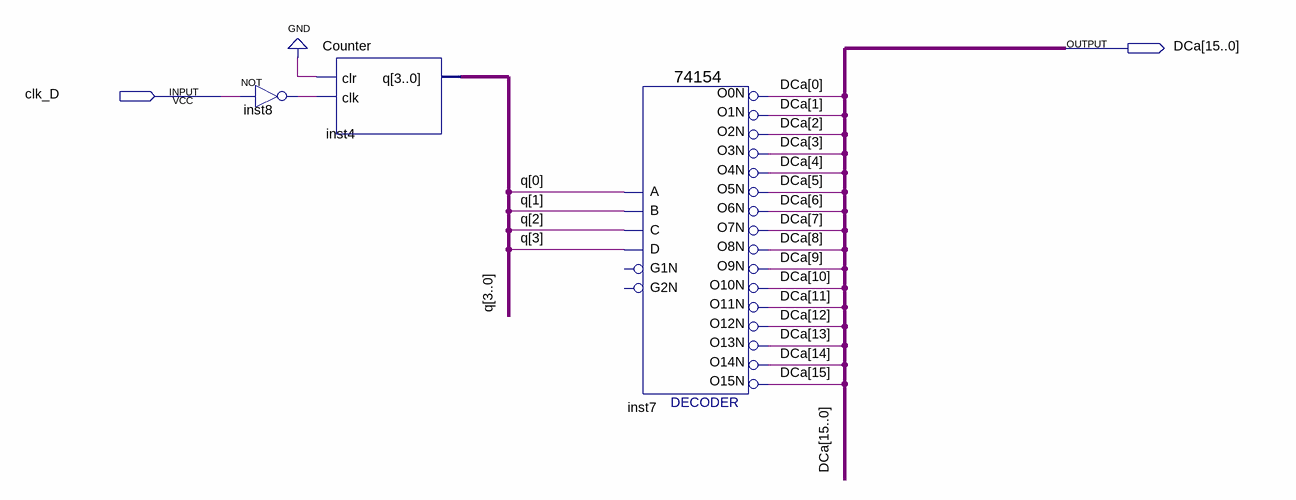
[diagram p0: schematic sheet]
// Quartus schematic Block3.bdf as structural Verilog: 3 symbols, 2 pins
module Block3 (
  input  clk_D,
  output [15:0] DCa
);

  wire inst8_out;
  wire [3:0] q;

  not inst8 (inst8_out, clk_D);
  Counter inst4 (.clr(1'b0), .clk(inst8_out), .q(q));
  \74154  inst7 (
    .C(q[2]), .D(q[3]), .B(q[1]), .A(q[0]), .O0N(DCa[0]), .O12N(DCa[12]), .O15N(DCa[15]), .O10N(DCa[10]),
    .O11N(DCa[11]), .O1N(DCa[1]), .O13N(DCa[13]), .O14N(DCa[14]), .O4N(DCa[4]), .O3N(DCa[3]), .O2N(DCa[2]),
    .O7N(DCa[7]), .O6N(DCa[6]), .O5N(DCa[5]), .O9N(DCa[9]), .O8N(DCa[8]));  // open: G1N, G2N
endmodule
